# EAGLE design LoRa-E5-Breakout (EAGLE 7.7.0)
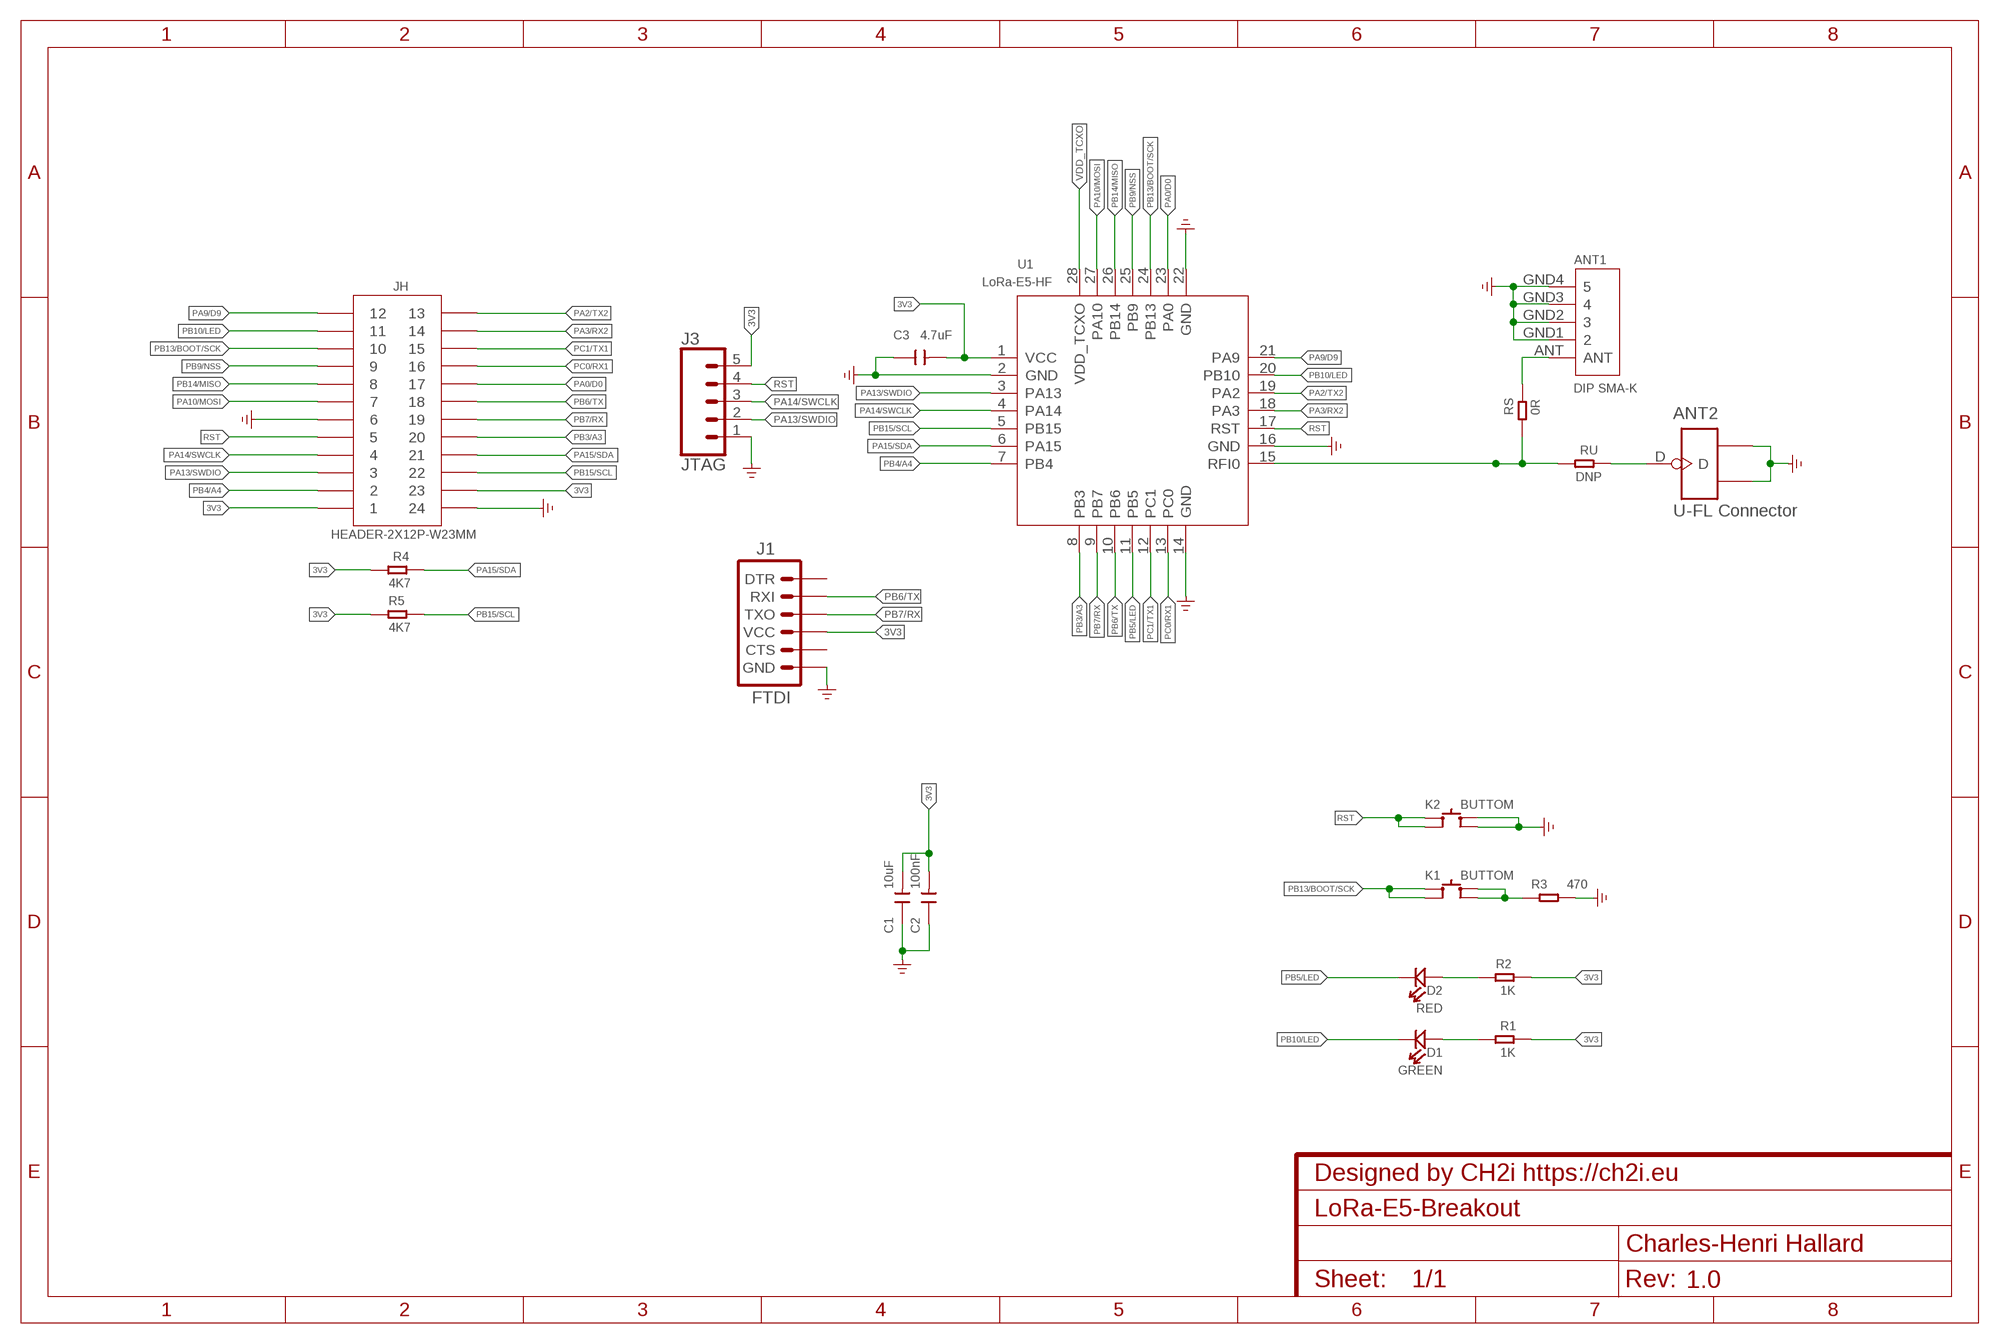
[diagram p0: schematic, sheet 1]
NAME (FRAME-A4L): CNAME: Designed by CH2i https://ch2i.eu; CREVISION: 1.0; DESIGNER: Charles-Henri Hallard

## Parts
ANT1  DIP SMA-K  ANTENNA-SMA-MCX-JE-320160125  [SMA5P-SMD-5.1-6.5X6.5X16.5MM]
ANT2  U-FL Connector  ANTENNA-U-FL-320110048  [U-FL3P-SMD-2.6X2.6X1.0MM]
C1  10uF  CAP-0805  [C0805]
C2  100nF  CAP-0805  [C0805]
C3  4.7uF  CAP-0805  [C0805]
D1  GREEN  LED'0805'  [LED-0805]
D2  RED  LED'0805'  [LED-0805]
J1  FTDI  6_PIN_SERIAL_TARGETSMD  [1X06-SMD_RA_MALE]
J3  JTAG  CONN_05LOCK  [1X05_LOCK]
JH  HEADER-2X12P-W23MM  [H2X12-2.54-23MM]
K1  BUTTOM  BUTTON-4P-4.5X3.2  [SW4P-SMD-4.5X3.2X2.5MM]
K2  BUTTOM  BUTTON-4P-4.5X3.2  [SW4P-SMD-4.5X3.2X2.5MM]
R1  1K  RES-0805  [R0805]
R2  1K  RES-0805  [R0805]
R3  470  RES-0805  [R0805]
R4  4K7  RES-0805  [R0805]
R5  4K7  RES-0805  [R0805]
RS  0R  RES-0603  [R0603]
RU  DNP  RES-0603  [R0603]
U1  LoRa-E5-HF  MOUDLE_LORA_E5  [MOUDLE28P-1.25-12X12X2.5MM]

## Nets
3V3: C1.2 C2.2 C3.2 J1.4(VCC) J3.5 JH.A1 JH.B1 JH.C11 JH.D11 JH.E1 JH.E23 JH.F1 JH.F23 R1.2 R2.2 R4.1 R5.1 U1.1(VCC)
GND: ANT1.GND1 ANT1.GND2 ANT1.GND3 ANT1.GND4 ANT2.GND1 ANT2.GND2 C1.1 C2.1 C3.1 J1.6(GND) J3.1 JH.A6 JH.B6 JH.C12 JH.D12 JH.E6 JH.E24 JH.F6 JH.F24 K2.3(B0) K2.4(B1) R3.2 U1.2(GND) U1.14(GND) U1.16(GND) U1.22(GND) ; supply symbol labelled GND_POWER
N$2: D1.+ R1.1
N$4: ANT2.D RU.2
N$12: D2.+ R2.1
N$13: ANT1.ANT RS.2
N$29: K1.3(B0) K1.4(B1) R3.1
PA0/D0: JH.C5 JH.D5 JH.E17 JH.F17 U1.23(PA0)
PA2/TX2: JH.C1 JH.D1 JH.E13 JH.F13 U1.19(PA2)
PA3/RX2: JH.C2 JH.D2 JH.E14 JH.F14 U1.18(PA3)
PA9/D9: JH.A12 JH.B12 JH.E12 JH.F12 U1.21(PA9)
PA10/MOSI: JH.A7 JH.B7 JH.E7 JH.F7 U1.27(PA10)
PA13/SWDIO: J3.2 JH.A3 JH.B3 JH.E3 JH.F3 U1.3(PA13)
PA14/SWCLK: J3.3 JH.A4 JH.B4 JH.E4 JH.F4 U1.4(PA14)
PA15/SDA: JH.C9 JH.D9 JH.E21 JH.F21 R4.2 U1.6(PA15)
PB3/A3: JH.C8 JH.D8 JH.E20 JH.F20 U1.8(PB3)
PB4/A4: JH.A2 JH.B2 JH.E2 JH.F2 U1.7(PB4)
PB5/LED: D2.- U1.11(PB5)
PB6/TX: J1.2(RXI) JH.C6 JH.D6 JH.E18 JH.F18 U1.10(PB6)
PB7/RX: J1.3(TXO) JH.C7 JH.D7 JH.E19 JH.F19 U1.9(PB7)
PB9/NSS: JH.A9 JH.B9 JH.E9 JH.F9 U1.25(PB9)
PB10/LED: D1.- JH.A11 JH.B11 JH.E11 JH.F11 U1.20(PB10)
PB13/BOOT/SCK: JH.A10 JH.B10 JH.E10 JH.F10 K1.1(A0) K1.2(A1) U1.24(PB13)
PB14/MISO: JH.A8 JH.B8 JH.E8 JH.F8 U1.26(PB14)
PB15/SCL: JH.C10 JH.D10 JH.E22 JH.F22 R5.2 U1.5(PB15)
PC0/RX1: JH.C4 JH.D4 JH.E16 JH.F16 U1.13(PC0)
PC1/TX1: JH.C3 JH.D3 JH.E15 JH.F15 U1.12(PC1)
RF: RS.1 RU.1 U1.15(RFI0)
RST: J3.4 JH.A5 JH.B5 JH.E5 JH.F5 K2.1(A0) K2.2(A1) U1.17(RST)
VDD_TCXO: U1.28(VDD_TCXO)
Unconnected: J1.1(DTR) J1.5(CTS)

## Library data of the parts
ANT1 = Connector-new:ANTENNA-SMA-MCX-JE
ANT2 = Connector-new:ANTENNA-U-FL
C1-C3 = Discrete-new:CAP: Ceramic Capacitors
D1 D2 = Discrete-new:LED
J1 = SparkFun-Connectors:6_PIN_SERIAL_TARGET: 6-pin header connection for use with the "FTDI BASIC" pinout - TARGET SIDE. Also known as "Arduino Serial Program Header". It is used to mate with our FTDI Basic serial programmers using the Arduino IDE. Note, this device has "TARGET" in the name. It is intended to be used on a design that contains a target micro-controller that you wish to program. The "sister" device, named "CABLE" is inteneded to be used on a design that usually lives on the end of your USB cable and prvides the converter chip (FTDI232 or FTDI231x) to commnicate serial RX/TX. You can populate with some of these: Break Away Headers - Straight <https://www.sparkfun.com/products/116> (PRT-00116) For reference (or to suit your programming needs) check out these designs: SparkFun FTDI Basic Breakout - 5V <https://www.sparkfun.com/products/9716> (DEV-09716) SparkFun FTDI Basic Breakout - 3.3V <https://www.sparkfun.com/products/9873> (DEV-09873) SparkFun FTDI SmartBasic <https://www.sparkfun.com/products/12935> (DEV-12935) SparkFun Beefy 3 - FTDI Basic Breakout <https://www.sparkfun.com/products/13746> (DEV-13746); PROD_ID: CONN-08971
J3 = SparkFun-Connectors:CONN_05: Multi connection point. Often used as Generic Header-pin footprint for 0.1 inch spaced/style header connections On any of the 0.1 inch spaced packages, you can populate with these: Break Away Headers - Straight <https://www.sparkfun.com/products/116> (PRT-00116) Break Away Male Headers - Right Angle <https://www.sparkfun.com/products/553> (PRT-00553) Female Headers <https://www.sparkfun.com/products/115> (PRT-00115) Break Away Headers - Machine Pin <https://www.sparkfun.com/products/117> (PRT-00117) Break Away Female Headers - Swiss Machine Pin <https://www.sparkfun.com/products/743> (PRT-00743) For SCREWTERMINALS and SPRING TERMINALS visit here: Screw Terimnals on SparkFun.com <https://www.sparkfun.com/search/results?term=Screw+Terminals> (5mm/3.5mm/2.54mm spacing) This device is also useful as a general connection point to wire up your design to another part of your project. Our various solder wires solder well into these plated through hole pads. Hook-Up Wire - Assortment (Stranded, 22 AWG) <https://www.sparkfun.com/products/11375> (PRT-11375) Hook-Up Wire - Assortment (Solid Core, 22 AWG) <https://www.sparkfun.com/products/11367> (PRT-11367) View the entire wire category on our website here <https://www.sparkfun.com/categories/141> Special notes: Molex polarized connector foot print use with SKU : PRT-08231 with associated crimp pins and housings. 1MM SMD Version SKU: PRT-10208
JH = Connector-new:HEADER-2X12P-W23MM
K1 K2 = Switch:BUTTON-4P
R1-R5 RS RU = Discrete-new:RES
U1 = moudle-new:MOUDLE_LORA_E5

## Board
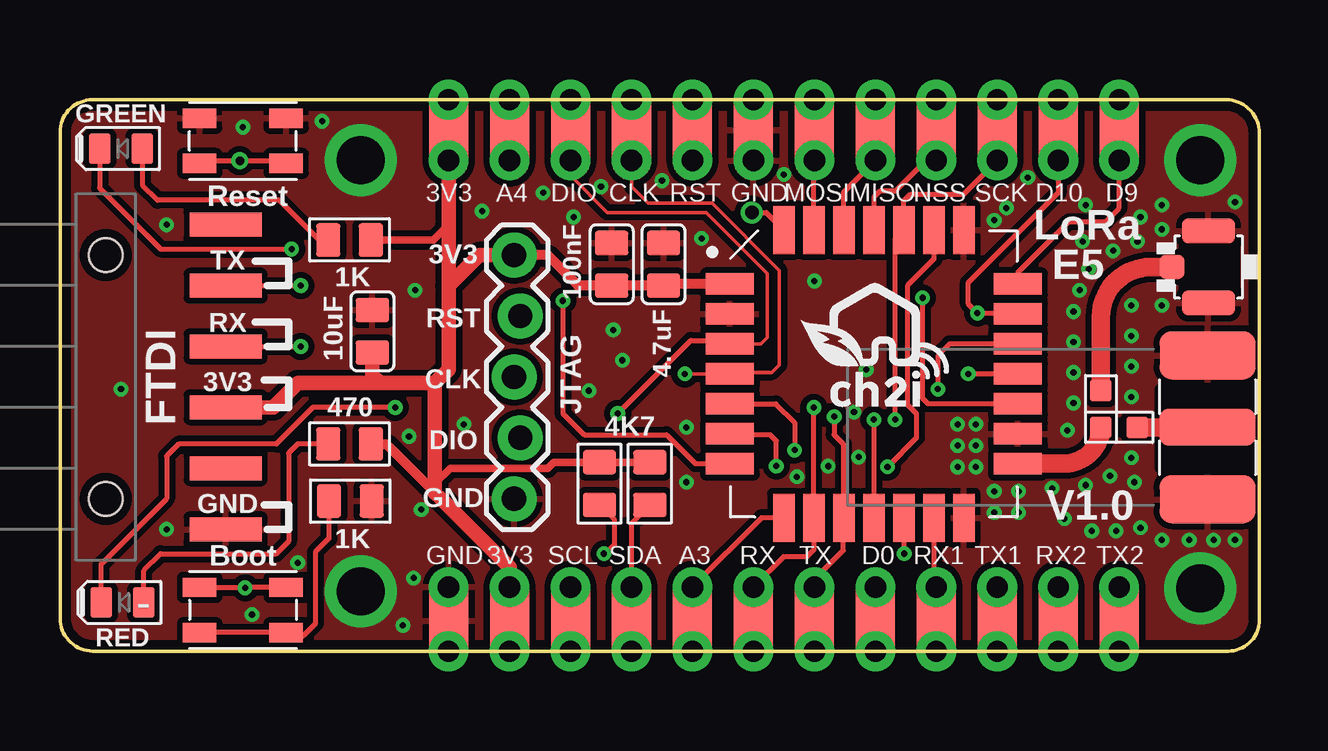
[diagram p1: board, top side]
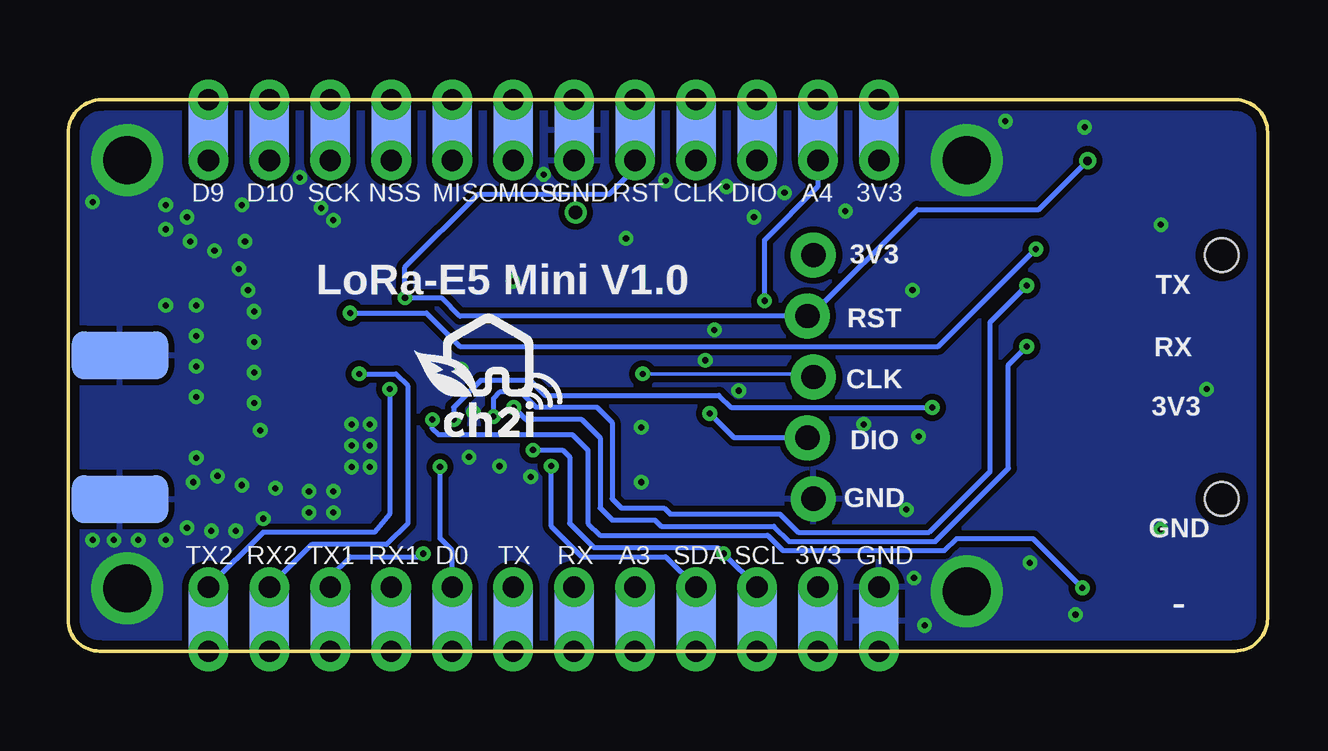
[diagram p2: board, bottom side, seen from below]

Size 49.97 x 22.99 mm. Coordinates in mm from the lower left corner, seen from the top.
Outline: 0,1.37 0,21.64 arc-90 1.35,22.99 48.58,22.99 arc-90 49.97,21.59 49.97,1.3 arc-90 48.67,0 1.37,0 arc-90 0,1.37
Copper layers (1*16): Top 0.0356mm / dielectric 1.5011mm / Bottom 0.0356mm
Design rules "oshpark-2layer *": minimum track width 6mil, minimum drill 10mil, track to track 6mil, track to pad 6mil, pad to pad 6mil, via to via 6mil, smd to smd 6mil, copper to edge 15mil, drill to drill 6mil, minimum pad ring 7mil, minimum via ring 7mil, stop-mask expansion 2.5mil, vias tented up to drill 20mil, thermal gap 10mil
tRestrict: area 45.8,7.6 to 49.5,10.9

### Footprints (pad centres in the part's own frame; a part is rotated, then mirrored left to right if it is on the bottom)
SMA5P-SMD-5.1-6.5X6.5X16.5MM = smd 4 x 1.524: ANT 0,0 | smd 4 x 2: GND1 0,3; GND2 0,-3 | smd 4 x 2 bottom: GND3 0,3; GND4 0,-3
U-FL3P-SMD-2.6X2.6X1.0MM = smd 1.05 x 1: D -1.524,0 | smd 2.2 x 1.05: GND1 0,1.5; GND2 0,-1.5
C0805 = smd 1.016 x 1.397: 1 -0.889,0; 2 0.889,0
LED-0805 = smd 0.889 x 1.27: + 0.889,0; - -0.889,0
1X06-SMD_RA_MALE = smd 1 x 3: 1 -6.35,5; 2 -3.81,5; 3 -1.27,5; 4 1.27,5; 5 3.81,5; 6 6.35,5 | hole 1.4: -5.08,0; 5.08,0
1X05_LOCK = drill 1.016 pad 1.88: 1 0,0.127; 2 2.54,-0.127; 3 5.08,0.127; 4 7.62,-0.127; 5 10.16,0.127
H2X12-2.54-23MM = drill 0.889 pad 1.651: A1 -13.97,11.5; A2 -11.43,11.5; A3 -8.89,11.5; A4 -6.35,11.5; A5 -3.81,11.5; A6 -1.27,11.5; A7 1.27,11.5; A8 3.81,11.5; A9 6.35,11.5; A10 8.89,11.5; A11 11.43,11.5; A12 13.97,11.5; B1 -13.97,8.96; B2 -11.43,8.96; B3 -8.89,8.96; B4 -6.35,8.96; B5 -3.81,8.96; B6 -1.27,8.96; B7 1.27,8.96; B8 3.81,8.96; B9 6.35,8.96; B10 8.89,8.96; B11 11.43,8.96; B12 13.97,8.96; C1 13.97,-11.5; C2 11.43,-11.5; C3 8.89,-11.5; C4 6.35,-11.5; C5 3.81,-11.5; C6 1.27,-11.5; C7 -1.27,-11.5; C8 -3.81,-11.5; C9 -6.35,-11.5; C10 -8.89,-11.5; C11 -11.43,-11.5; C12 -13.97,-11.5; D1 13.97,-8.82; D2 11.43,-8.82; D3 8.89,-8.82; D4 6.35,-8.82; D5 3.81,-8.82; D6 1.27,-8.82; D7 -1.27,-8.82; D8 -3.81,-8.82; D9 -6.35,-8.82; D10 -8.89,-8.82; D11 -11.43,-8.82; D12 -13.97,-8.82 | smd 1.65 x 4.2: E1 -13.97,10.23; E2 -11.43,10.23; E3 -8.89,10.23; E4 -6.35,10.23; E5 -3.81,10.23; E6 -1.27,10.23; E7 1.27,10.23; E8 3.81,10.23; E9 6.35,10.23; E10 8.89,10.23; E11 11.43,10.23; E12 13.97,10.23; E13 13.97,-10.23; E14 11.43,-10.23; E15 8.89,-10.23; E16 6.35,-10.23; E17 3.81,-10.23; E18 1.27,-10.23; E19 -1.27,-10.23; E20 -3.81,-10.23; E21 -6.35,-10.23; E22 -8.89,-10.23; E23 -11.43,-10.23; E24 -13.97,-10.23 | smd 1.65 x 4.2 bottom: F1 -13.97,10.23; F2 -11.43,10.23; F3 -8.89,10.23; F4 -6.35,10.23; F5 -3.81,10.23; F6 -1.27,10.23; F7 1.27,10.23; F8 3.81,10.23; F9 6.35,10.23; F10 8.89,10.23; F11 11.43,10.23; F12 13.97,10.23; F13 13.97,-10.23; F14 11.43,-10.23; F15 8.89,-10.23; F16 6.35,-10.23; F17 3.81,-10.23; F18 1.27,-10.23; F19 -1.27,-10.23; F20 -3.81,-10.23; F21 -6.35,-10.23; F22 -8.89,-10.23; F23 -11.43,-10.23; F24 -13.97,-10.23
SW4P-SMD-4.5X3.2X2.5MM = smd 1.4 x 0.8: 1 -1.8,-0.94; 2 1.8,-0.94; 3 1.8,0.94; 4 -1.8,0.94
R0805 = smd 1.016 x 1.397: 1 -0.889,0; 2 0.889,0
R0603 = smd 0.889 x 0.889: 1 -0.762,0; 2 0.762,0
MOUDLE28P-1.25-12X12X2.5MM = smd 2 x 0.9: 1 -6,3.75; 2 -6,2.5; 3 -6,1.25; 4 -6,0; 5 -6,-1.25; 6 -6,-2.5; 7 -6,-3.75; 15 6,-3.75; 16 6,-2.5; 17 6,-1.25; 18 6,0; 19 6,1.25; 20 6,2.5; 21 6,3.75 | smd 0.9 x 2: 8 -3.75,-6; 9 -2.5,-6; 10 -1.25,-6; 11 0,-6; 12 1.25,-6; 13 2.5,-6; 14 3.75,-6; 22 3.75,6; 23 2.5,6; 24 1.25,6; 25 0,6; 26 -1.25,6; 27 -2.5,6; 28 -3.75,6

### Placement (x,y rotation side)
ANT1  47.82,9.33 180 top
ANT2  47.85,16.01 0 top
C1  13.02,13.34 270 top
C2  22.99,16.13 270 top
C3  25.15,16.13 270 top
D1  2.54,20.95 0 top
D2  2.6,2.03 0 top
J1  1.91,11.43 270 top
J3  19.05,6.35 90 top
JH  30.16,11.49 0 top
K1  7.62,1.71 180 top
K2  7.62,21.27 0 top
R1  12.06,17.14 0 top
R2  12.06,8.64 0 top
R3  12.1,6.25 0 top
R4  24.57,6.99 270 top
R5  22.48,6.99 270 top
RS  44.13,9.33 0 top
RU  43.37,10.1 90 top
U1  33.91,11.56 0 top
U$1  [LOGO_C2I_015]  30.86,10.16 0 top
U$2  [LOGO_C2I_015]  35.56,8.89 0 bottom

### Tracks (layer width: path | path; a pad name or v marks a point on that pad's centre or on a via)
3V3
  Top 0.152: JH.F1 16.19,21.27 16.51,20.95 16.51,22.68 JH.A1
  Top 0.203: JH.D11 JH.F23
  Top 0.305: R1.2 15.56,17.14 16.19,17.78 | R4.1 R5.1 20.57,7.87 20.32,7.62 16.26,7.62 15.62,6.99
  Top 0.406: JH.C11 JH.F23 | U1.1 25.21,15.31 C3.2 C2.2 21.59,15.24 20.32,16.51 J3.5 | R2.2 13.59,8.64 15.88,6.35
  Top 0.61: 25.21,15.31 arc90 C3.2 | 15.62,11.18 16.19,11.75 16.19,15.24 | J1.4 8.89,10.16 9.91,11.18 13.34,11.18 | 13.34,11.18 15.62,11.18 | C1.2 13.02,11.49 13.34,11.18 | JH.B1 16.19,17.78 16.19,15.24 | J3.5 17.46,16.51 16.19,15.24 | 15.62,11.18 15.62,6.99 15.62,6.6 15.88,6.35 18.73,3.49 JH.D11
  Bottom 0.203: JH.D11 19.44,2.67 | JH.B1 JH.F1 JH.A1
  Bottom 0.406: JH.F23 JH.C11
GND  (via drill 0.25 pad 0.51, 2 pad 3)
  Top 0.203: 49.21,6.22 47.94,6.22
  Top 0.406: ANT1.GND1 47.94,6.22
  other vias: 47.51,20.47 47.51,2.62 12.52,2.5 12.52,20.47 14.29,1.08 45.91,17.59 10.92,22.1 39.43,18.48 40.32,19.75 26.1,9.33 8,1.52 7.62,21.84 14.73,3.05 38.93,17.97 30.16,19.87 33.59,11.74 33.08,9.97 26.1,7.04 23.05,13.39 21.4,18.09 26.73,17.2 16.83,9.46 42.74,18.6 30.7,7.27 32,7.71 23.43,12.12 31.43,15.43 20.13,19.11 25.08,19.62 22.54,19.36 33.27,8.09 14.54,8.95 14.8,15.05 15.05,5.9 17.59,18.35 9.91,3.68 4.45,5.08 2.54,10.92 4.45,17.78 22.03,10.86 45.91,14.41 44.89,17.08 43.88,16.7 42.86,15.94 42.48,15.05 42.23,14.16 42.23,12.89 42.23,11.62 42.23,10.35 41.97,9.2 44.64,14.41 44.64,13.14 44.64,11.87 44.64,10.6 44.64,8.06 38.16,9.46 38.16,8.57 38.16,7.68 37.4,9.46 37.4,8.57 37.4,7.68 38.93,6.66 39.94,6.66 41.34,6.79 42.74,6.92 43.75,7.3 44.77,7.04 45.02,5.14 45.91,4.63 48.96,4.63 48.07,4.63 47.05,4.63 45.91,18.6 48.96,18.73 45.02,18.09 42.61,17.08 44.01,5.01 42.99,5.01 39.94,5.78 38.93,5.78 41.85,5.52
  pour Bottom (isolate 0.254): -1.27,22.86 50.8,22.86 50.8,-0.64 -1.27,-0.64
  pour Top (isolate 0.254, rank 3): -0.64,23.5 50.16,23.5 50.16,0 -0.64,0
N$2
  Top 0.203: R1.1 10.79,17.14 9.14,18.8 4.06,18.8 3.43,19.43 D1.+
N$4
  Top 0.762: ANT2.D 45.45,16.02 arc90 43.37,13.94 RU.2
N$12
  Top 0.203: D2.+ 3.49,3.37 4.19,4.06 9.02,4.06 9.53,4.57 9.53,8.26 9.91,8.64 R2.1
N$13
  Top 0.483: 47.18,9.34 47.24,9.4 47.75,9.4 ANT1.ANT
  Top 0.65: 47.75,9.27 ANT1.ANT
  Top 0.762: RS.2 ANT1.ANT
N$29
  Top 0.203: K1.3 K1.4 9.43,0.64 10.13,0.64 10.64,1.14 10.64,4.13 11.21,4.7 R3.1
PA0/D0  (via drill 0.25 pad 0.51)
  Top 0.203: U1.23 36.41,16.34 35.31,15.24 35.31,10.29 35.69,9.91 35.69,8.89 v34.48,7.68
  Top 0.406: JH.D5 JH.E17 JH.C5
  Bottom 0.203: JH.D5 33.97,4.19 34.48,4.7 v34.48,7.68
  Bottom 0.406: JH.E17 JH.C5
PA2/TX2  (via drill 0.25 pad 0.51)
  Top 0.203: U1.19 37.06,12.81 36.58,12.32 v36.58,10.92
  Top 0.406: JH.C1 JH.F13 JH.D1
  Bottom 0.203: 44.07,2.74 JH.D1 41.85,4.95 37.21,4.95 36.58,5.71 v36.58,10.92
  Bottom 0.406: JH.D1 JH.F13 JH.C1
PA3/RX2  (via drill 0.25 pad 0.51)
  Top 0.203: U1.18 v37.85,11.56
  Top 0.406: JH.C2 JH.E14 JH.D2
  Bottom 0.203: 41.53,2.74 JH.D2 39.82,4.45 36.7,4.45 35.81,5.33 35.81,11.05 36.32,11.56 v37.85,11.56
  Bottom 0.406: JH.D2 JH.E14 JH.C2
PA9/D9
  Top 0.203: U1.21 39.91,15.78 42.04,17.91 43.56,17.91 44.13,18.48 JH.B12
  Top 0.406: JH.B12 JH.E12 | JH.E12 JH.A12 | JH.E12 JH.B12 44.16,20.45 44.16,22.95 44.13,22.95 JH.E12
  Bottom 0.406: JH.A12 JH.E12
PA10/MOSI
  Top 0.203: U1.27 31.41,20.43 JH.B7
  Top 0.406: JH.B7 JH.E7 JH.A7
  Bottom 0.406: JH.E7 JH.B7
PA13/SWDIO  (via drill 0.25 pad 0.51)
  Top 0.152: U1.3 29.19,12.81 29.46,13.08 29.46,15.75 26.92,18.29 22.8,18.29 21.27,19.82 JH.B3
  Top 0.203: v23.24,9.91 26.29,12.95 27.76,12.95 U1.3
  Top 0.406: JH.B3 JH.F3 JH.A3
  Bottom 0.203: J3.2 22.23,8.89 v23.24,9.91
  Bottom 0.406: JH.F3 JH.B3
PA14/SWCLK  (via drill 0.25 pad 0.51)
  Top 0.152: 27.97,11.62 29.65,11.62 29.97,11.94 29.97,15.88 27.18,18.67 24.51,18.67 23.81,19.37 JH.B4 | v26.04,11.56 U1.4
  Top 0.203: JH.B4 24.12,20.45 | 27.78,11.43 U1.4 27.97,11.62
  Top 0.406: JH.B4 JH.F4 JH.A4
  Bottom 0.152: v26.04,11.56 19.05,11.56 J3.3
  Bottom 0.406: JH.F4 JH.B4
PA15/SDA  (via drill 0.25 pad 0.51)
  Top 0.203: v29.84,7.71 29.84,8.76 29.59,9.02 27.95,9.02 U1.6 | 24.04,2.9 JH.D9 23.81,5.33 R4.2 24.51,6.1 24.13,5.71
  Top 0.406: JH.D9 JH.E21 JH.C9
  Bottom 0.203: v29.84,7.71 29.84,5.21 28.57,3.94 25.08,3.94 JH.D9
  Bottom 0.406: JH.E21 JH.C9
PB3/A3
  Top 0.203: U1.8 29.24,5.56 JH.D8
  Top 0.406: JH.D8 JH.E20 JH.C8
  Bottom 0.406: JH.E20 JH.C8
PB4/A4  (via drill 0.25 pad 0.51)
  Top 0.152: JH.A2 JH.F2 JH.B2
  Top 0.203: 27.94,7.78 U1.7 26.48,7.81 25.27,9.02 21.84,9.02 20.95,9.91 v20.95,14.61
  Bottom 0.203: v20.95,14.61 20.95,17.14 18.73,19.37 JH.B2
  Bottom 0.406: JH.F2 JH.B2
PB5/LED  (via drill 0.25 pad 0.51)
  Top 0.203: v33.91,9.65 U1.11 | D2.- 1.71,3.62 4.45,6.35 4.45,8.13 4.95,8.64 9.02,8.64 10.54,10.16 v13.97,10.16
  Bottom 0.203: v33.91,9.65 33.91,10.16 32.77,11.3 30.73,11.3 30.1,10.67 22.86,10.67 22.35,10.16 v13.97,10.16
PB6/TX  (via drill 0.25 pad 0.51)
  Top 0.152: 31.52,2.76 JH.D6
  Top 0.203: 31.52,2.76 31.52,3.07 32.64,4.19 32.64,5.54 U1.10 32.64,5.58 32.64,8.64 32.26,9.02 v32.26,9.78 | J1.2 v10.03,15.24
  Top 0.406: JH.D6 JH.E18 JH.C6
  Bottom 0.203: v32.26,9.78 32.26,10.54 32,10.79 31.11,10.79 30.48,10.16 27.94,10.16 27.3,9.53 27.3,6.35 26.92,5.97 25.15,5.97 24.89,5.71 20.32,5.71 19.56,4.95 14.1,4.95 11.56,7.49 11.56,13.72 v10.03,15.24
  Bottom 0.406: JH.E18 JH.C6
PB7/RX  (via drill 0.25 pad 0.51)
  Top 0.203: JH.D7 30.16,3.94 31.11,3.94 31.41,4.23 U1.9 v31.41,10.16 | J1.3 v10.03,12.7
  Top 0.406: JH.D7 JH.E19 JH.C7
  Bottom 0.203: v31.41,10.16 30.9,9.65 28.57,9.65 27.81,8.89 27.81,5.97 27.3,5.46 25.53,5.46 25.27,5.21 20.57,5.21 19.94,4.57 13.84,4.57 10.79,7.62 10.79,11.94 v10.03,12.7
  Bottom 0.406: JH.E19 JH.C7
PB9/NSS
  Top 0.203: JH.B9 36.32,20.26 35.88,20.26 34.8,19.18 34.16,19.18 33.91,18.92 U1.25
  Top 0.406: JH.B9 36.51,20.89 36.32,21.08 36.32,21.53 JH.E9 JH.A9
  Bottom 0.406: JH.E9 JH.B9
PB10/LED  (via drill 0.25 pad 0.51)
  Top 0.152: 41.59,20.38 JH.B11
  Top 0.203: D1.- 1.65,19.3 4.19,16.76 v9.65,16.76 | JH.B11 41.59,19.11 37.85,15.37 37.85,14.48 v38.23,14.1 39.87,14.1 U1.20
  Top 0.406: JH.A11 JH.E11 JH.B11
  Bottom 0.203: v38.23,14.1 35.05,14.1 33.66,12.7 13.72,12.7 v9.65,16.76
  Bottom 0.406: 41.59,22.23 JH.E11 JH.B11
PB13/BOOT/SCK  (via drill 0.25 pad 0.51)
  Top 0.203: JH.B10 37.65,19.05 35.43,19.05 35.16,18.78 U1.24 34.8,17.2 v34.8,9.65 | K1.2 7.48,2.65 | K1.1 7.48,2.65 | 7.48,2.65 v7.71,2.63
  Top 0.406: JH.B10 39.05,21.02 38.99,21.08 38.99,21.66 | 38.99,21.66 38.99,22.93 JH.A10 | 38.99,21.66 JH.F10
  Bottom 0.203: v34.8,9.65 34.8,9.27 34.54,9.02 28.96,9.02 28.32,8.38 28.32,5.33 27.81,4.83 20.83,4.83 20.19,4.19 13.46,4.19 12.95,4.7 9.78,4.7 v7.71,2.63
  Bottom 0.406: JH.F10 JH.B10
PB14/MISO
  Top 0.152: 33.4,20.45 JH.B8
  Top 0.203: U1.26 32.66,19.14 JH.B8
  Top 0.406: JH.B8 JH.E8 JH.A8
  Bottom 0.406: JH.E8 JH.B8
PB15/SCL  (via drill 0.25 pad 0.51)
  Top 0.203: U1.5 29.82,10.31 30.61,9.53 v30.61,8.38 | 21.97,6.1 R5.2 23.11,5.46 23.11,4.45 22.73,4.06 v22.66,4.06
  Top 0.406: JH.D10 JH.F22 JH.C10
  Bottom 0.203: v30.61,8.38 29.37,8.38 29.08,8.1 29.08,5.33 28.07,4.32 22.92,4.32 v22.66,4.06 JH.D10
  Bottom 0.406: JH.F22 JH.C10
PC0/RX1
  Top 0.203: U1.13 36.41,2.78 JH.D4
  Top 0.406: JH.D4 JH.E16 JH.C4
  Bottom 0.406: JH.E16 JH.C4
PC1/TX1  (via drill 0.25 pad 0.51)
  Top 0.152: JH.C3 JH.E15 JH.D3
  Top 0.203: U1.12 35.16,4.21 v35.18,4.06
  Bottom 0.203: JH.D3 39.05,3.11 38.23,3.94 35.31,3.94 v35.18,4.06
  Bottom 0.406: JH.E15 JH.C3
RF
  Top 0.483: 39.93,7.83 U1.15
  Top 0.762: 39.93,7.83 41.86,7.83 arc90 RU.1
RST  (via drill 0.25 pad 0.51, 0.36 pad 0.71)
  Top 0.203: K2.2 9.4,20.44 7.5,20.44 v7.49,20.45 5.96,20.46 K2.1 | U1.17 36.17,10.31 35.94,10.54 v35.94,14.73
  Top 0.406: JH.E5 JH.A5
  Bottom 0.203: JH.B5 26.42,20.39 26.42,20.07 27.43,19.05 32.89,19.05 35.94,16 v35.94,14.73 34.42,14.73 33.66,13.97 J3.4 19.05,13.97 14.61,18.41 9.53,18.41 v7.49,20.45
  Bottom 0.406: JH.A5 JH.E5 JH.B5
VDD_TCXO  (via drill 0.56)
  Top 0.203: 29.81,17.56 U1.28 29.43,18.29 v28.83,18.29

### Text on the board
tPlace: LoRa | E5 | V1.0
bPlace: LoRa-E5 Mini V1.0 | -
tNames: Reset | 3V3 | A4 | DIO | CLK | RST | GND | MOSI | MISO | NSS | SCK | D10 | D9 | 3V3 | TX | RX | RST | JTAG | 3V3 | CLK | DIO | GND | GND | Boot | GND | 3V3 | SCL | SDA | A3 | RX | TX | D0 | RX1 | TX1 | RX2 | TX2 | -
bNames: 3V3 | A4 | DIO | CLK | RST | GND | MOSI | MISO | NSS | SCK | D10 | D9 | 3V3 | TX | RST | RX | CLK | 3V3 | DIO | GND | GND | GND | 3V3 | SCL | SDA | A3 | RX | TX | D0 | RX1 | TX1 | RX2 | TX2
tTest: U1